# EAGLE schematic card (EAGLE 7.6.0)
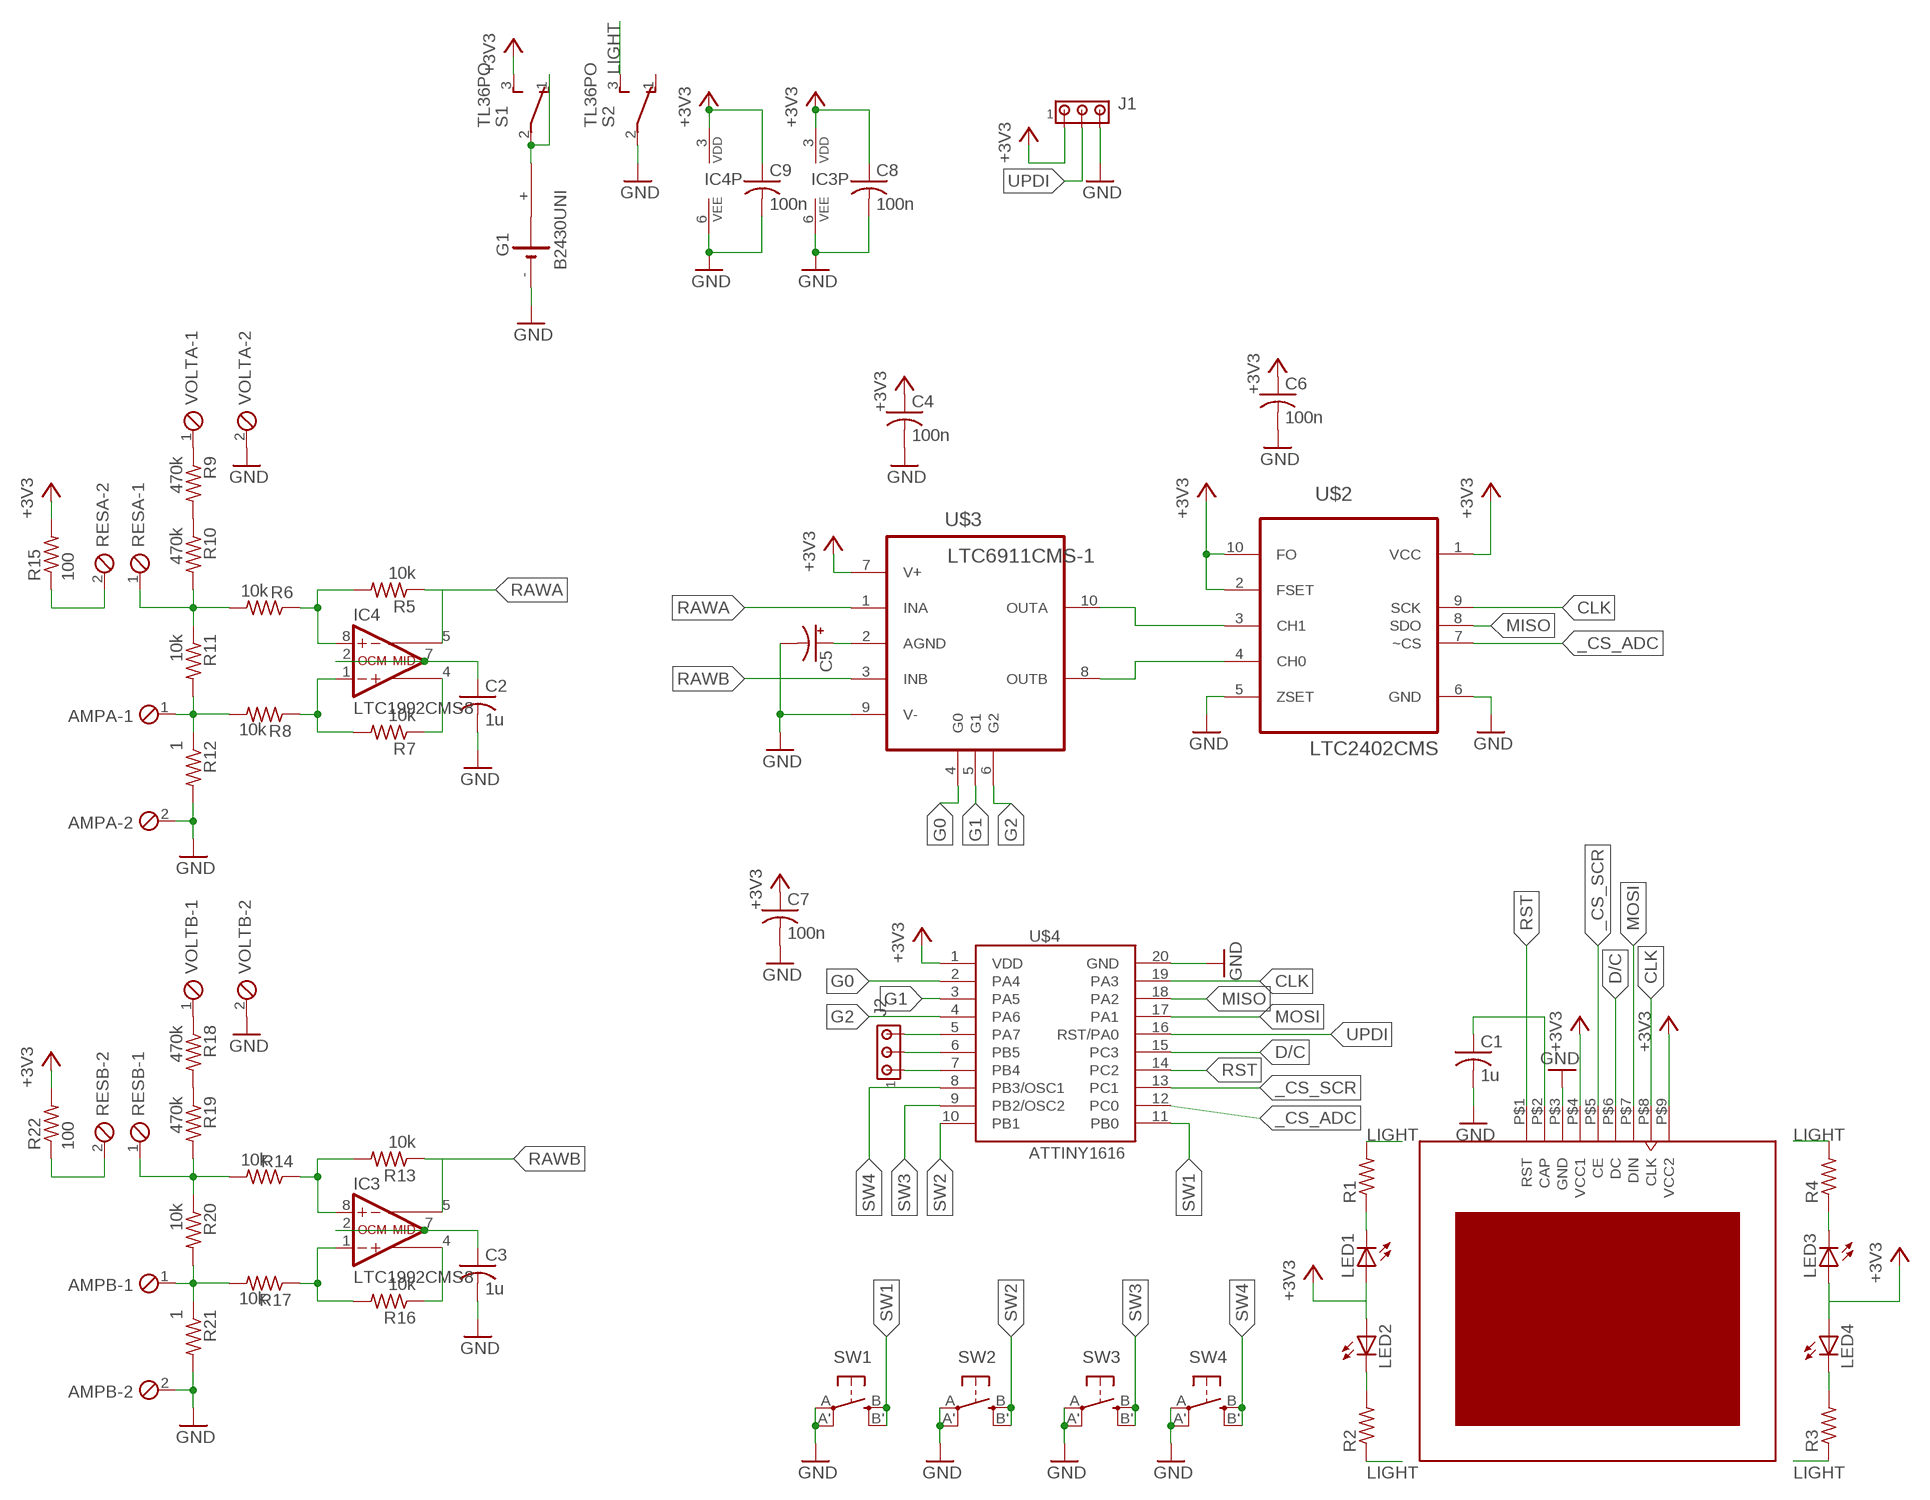
[diagram p0: schematic, sheet 1]

## Parts
AMPA  MPT2  [2POL254]
AMPB  MPT2  [2POL254]
C1  1u  C-USC0805  [C0805]
C2  1u  C-USC0805  [C0805]
C3  1u  C-USC0805  [C0805]
C4  100n  C-USC0805K  [C0805K]
C5  CPOL-USA/3216-18R  [A/3216-18R]
C6  100n  C-USC0805K  [C0805K]
C7  100n  C-USC0805K  [C0805K]
C8  100n  C-USC0805K  [C0805K]
C9  100n  C-USC0805K  [C0805K]
G1  B2430UNI  [B2430UNI]
IC3  LTC1992CMS8  [MSOP8]
IC4  LTC1992CMS8  [MSOP8]
J1  MTA03-100  [10X03MTA]
J2  MTA03-100  [10X03MTA]
LED1  LEDCHIP-LED0805  [CHIP-LED0805]
LED2  LEDCHIP-LED0805  [CHIP-LED0805]
LED3  LEDCHIP-LED0805  [CHIP-LED0805]
LED4  LEDCHIP-LED0805  [CHIP-LED0805]
R1  R-US_M0805  [M0805]
R2  R-US_M0805  [M0805]
R3  R-US_M0805  [M0805]
R4  R-US_M0805  [M0805]
R5  10k  R-US_M0805  [M0805]
R6  10k  R-US_M0805  [M0805]
R7  10k  R-US_M0805  [M0805]
R8  10k  R-US_M0805  [M0805]
R9  470k  R-US_M0805  [M0805]
R10  470k  R-US_M0805  [M0805]
R11  10k  R-US_M0805  [M0805]
R12  1  R-US_M0805  [M0805]
R13  10k  R-US_M0805  [M0805]
R14  10k  R-US_M0805  [M0805]
R15  100  R-US_M0805  [M0805]
R16  10k  R-US_M0805  [M0805]
R17  10k  R-US_M0805  [M0805]
R18  470k  R-US_M0805  [M0805]
R19  470k  R-US_M0805  [M0805]
R20  10k  R-US_M0805  [M0805]
R21  1  R-US_M0805  [M0805]
R22  100  R-US_M0805  [M0805]
RESA  MPT2  [2POL254]
RESB  MPT2  [2POL254]
S1  TL36PO  [TL3XPO]
S2  TL36PO  [TL3XPO]
SW1  SPST_TACT-EVQQ2  [EVQ-Q2]
SW2  SPST_TACT-EVQQ2  [EVQ-Q2]
SW3  SPST_TACT-EVQQ2  [EVQ-Q2]
SW4  SPST_TACT-EVQQ2  [EVQ-Q2]
U$1  NOKIA_SCREEN  [NOKIA_SCREEN]
U$2  LTC2402CMS  [MSOP10]
U$3  LTC6911CMS-1  [MSOP10]
U$4  ATTINY1616  [SO20W]
VOLTA  MPT2  [2POL254]
VOLTB  MPT2  [2POL254]

## Nets
+3V3: C4.1 C6.1 C7.1 C8.1 C9.1 IC3.3(VDD) IC4.3(VDD) J1.1 LED1.A LED2.A LED3.A LED4.A R15.2 R22.2 S1.3(S) U$1.P$4(VCC1) U$1.P$9(VCC2) U$2.1(VCC) U$2.2(FSET) U$2.10(FO) U$3.7(V+) U$4.1(VDD)
_CS_ADC: U$2.7(~CS) U$4.12(PC0)
_CS_SCR: U$1.P$5(CE) U$4.13(PC1)
CLK: U$1.P$8(CLK) U$2.9(SCK) U$4.19(PA3)
D/C: U$1.P$6(DC) U$4.15(PC3)
G0: U$3.4(G0) U$4.2(PA4)
G1: U$3.5(G1) U$4.3(PA5)
G2: U$3.6(G2) U$4.4(PA6)
GND: AMPA.2 AMPB.2 C1.2 C2.2 C3.2 C4.2 C5.- C6.2 C7.2 C8.2 C9.2 G1.- IC3.6(VEE) IC4.6(VEE) J1.3 R12.2 R21.2 S2.2(P) SW1.A'(P1) SW1.A(P) SW2.A'(P1) SW2.A(P) SW3.A'(P1) SW3.A(P) SW4.A'(P1) SW4.A(P) U$1.P$3(GND) U$2.5(ZSET) U$2.6(GND) U$3.9(V-) U$4.20(GND) VOLTA.2 VOLTB.2
LIGHT: R1.2 R2.1 R3.1 R4.2 S2.3(S)
MISO: U$2.8(SDO) U$4.18(PA2)
MOSI: U$1.P$7(DIN) U$4.17(PA1)
N$1: G1.+ S1.1(O) S1.2(P)
N$2: LED1.C R1.1
N$3: C1.1 U$1.P$2(CAP)
N$4: LED2.C R2.2
N$5: LED4.C R3.2
N$6: LED3.C R4.1
N$7: J2.1 U$4.7(PB4)
N$8: J2.3 U$4.5(PA7)
N$9: J2.2 U$4.6(PB5)
N$16: IC4.1(-IN) R7.2 R8.1
N$17: IC4.8(+IN) R5.2 R6.1
N$18: C5.+ U$3.2(AGND)
N$19: IC4.4(+OUT) R7.1
N$21: C2.1 IC4.2(OCM) IC4.7(MID)
N$22: R9.2 R10.1
N$23: R6.2 R10.2 R11.1 RESA.1
N$24: AMPA.1 R8.2 R11.2 R12.1
N$25: IC3.1(-IN) R16.2 R17.1
N$26: IC3.8(+IN) R13.2 R14.1
N$27: R9.1 VOLTA.1
N$28: R15.1 RESA.2
N$29: U$2.4(CH0) U$3.8(OUTB)
N$30: IC3.4(+OUT) R16.1
N$31: C3.1 IC3.2(OCM) IC3.7(MID)
N$32: R18.2 R19.1
N$33: R14.2 R19.2 R20.1 RESB.1
N$34: AMPB.1 R17.2 R20.2 R21.1
N$35: R18.1 VOLTB.1
N$36: R22.1 RESB.2
N$37: U$2.3(CH1) U$3.10(OUTA)
RAWA: IC4.5(-OUT) R5.1 U$3.1(INA)
RAWB: IC3.5(-OUT) R13.1 U$3.3(INB)
RST: U$1.P$1(RST) U$4.14(PC2)
SW1: SW1.B'(S1) SW1.B(S) U$4.11(PB0)
SW2: SW2.B'(S1) SW2.B(S) U$4.10(PB1)
SW3: SW3.B'(S1) SW3.B(S) U$4.9(PB2/OSC2)
SW4: SW4.B'(S1) SW4.B(S) U$4.8(PB3/OSC1)
UPDI: J1.2 U$4.16(RST/PA0)
Unconnected: G1.+@1(+) G1.+@2(+) G1.+@3(+) G1.+@4(+) G1.-@1(-) S2.1(O)

## Library data of the parts
AMPA AMPB RESA RESB VOLTA VOLTB = con-phoenix-254:MPT2: PHOENIX CONNECTOR; OC_FARNELL: unknown; OC_NEWARK: unknown
C1-C3 = resistor:C-US: CAPACITOR, American symbol
C4 C6-C9 = adafruit:C-US: CAPACITOR, American symbol
C5 = adafruit:CPOL-US: POLARIZED CAPACITOR, American symbol
G1 = battery:B2430UNI: LI BATTERY
IC3 IC4 = linear-technology-2:LTC1992*: Low Power, Fully Differential Input/Output Amplifier/Driver
J1 J2 = con-amp:MTA03-100: AMP connector
LED1-LED4 = adafruit:LED: LED OSRAM: - CHIPLED LG R971, LG N971, LY N971, LG Q971, LY Q971, LO R971, LY R971 LH N974, LH R974 LS Q976, LO Q976, LY Q976 LO Q996 - Hyper CHIPLED LW Q18S LB Q993, LB Q99A, LB R99A - SideLED LS A670, LO A670, LY A670, LG A670, LP A670 LB A673, LV A673, LT A673, LW A673 LH A674 LY A675 LS A676, LA A676, LO A676, LY A676, LW A676 LS A679, LY A679, LG A679 - Hyper Micro SIDELED® LS Y876, LA Y876, LO Y876, LY Y876 LT Y87S - SmartLED LW L88C, LW L88S LB L89C, LB L89S, LG L890 LS L89K, LO L89K, LY L89K LS L896, LA L896, LO L896, LY L896 - TOPLED LS T670, LO T670, LY T670, LG T670, LP T670 LSG T670, LSP T670, LSY T670, LOP T670, LYG T670 LG T671, LOG T671, LSG T671 LB T673, LV T673, LT T673, LW T673 LH T674 LS T676, LA T676, LO T676, LY T676, LB T676, LH T676, LSB T676, LW T676 LB T67C, LV T67C, LT T67C, LS T67K, LO T67K, LY T67K, LW E67C LS E67B, LA E67B, LO E67B, LY E67B, LB E67C, LV E67C, LT E67C LW T67C LS T679, LY T679, LG T679 LS T770, LO T770, LY T770, LG T770, LP T770 LB T773, LV T773, LT T773, LW T773 LH T774 LS E675, LA E675, LY E675, LS T675 LS T776, LA T776, LO T776, LY T776, LB T776 LHGB T686 LT T68C, LB T68C - Hyper Mini TOPLED® LB M676 - Mini TOPLED Santana® LG M470 LS M47K, LO M47K, LY M47K Source: http://www.osram.convergy.de/
R1-R22 = resistor:R-US_: RESISTOR, American symbol
S1 S2 = switch:TL36PO: TINY SWITCH ON - ON Source: http://www2.produktinfo.conrad.com/datenblaetter/700000-724999/705152-da-01-de-Subminiaturschalter_TL_36YO.pdf
SW1-SW4 = adafruit:SPST_TACT: SMT 6mm switch, EVQQ2 series http://www.ladyada.net/library/eagle
U$1 = HomeMade:NOKIA_SCREEN
U$2 = HomeMade:LTC2402CMS
U$3 = HomeMade:LTC6911CMS-1
U$4 = HomeMade:ATTINY1616